# Altium schematic sheet Connectors.SchDoc
size 381 x 279 mm; Organization: SACO Technologies; Address1: 7806, Trans-Canada Hwy; Address2: Montreal, QC, Canada - H4S1L3.; Address3: H4S1L3; SheetNumber: 6; SheetTotal: 6; ELE682ProjectName: Conditionning & TLL PCB; ProjectRevision: C; SchDesignedBy1: Alexis Gagnon; SchDesignedBy2: Megane Cyr
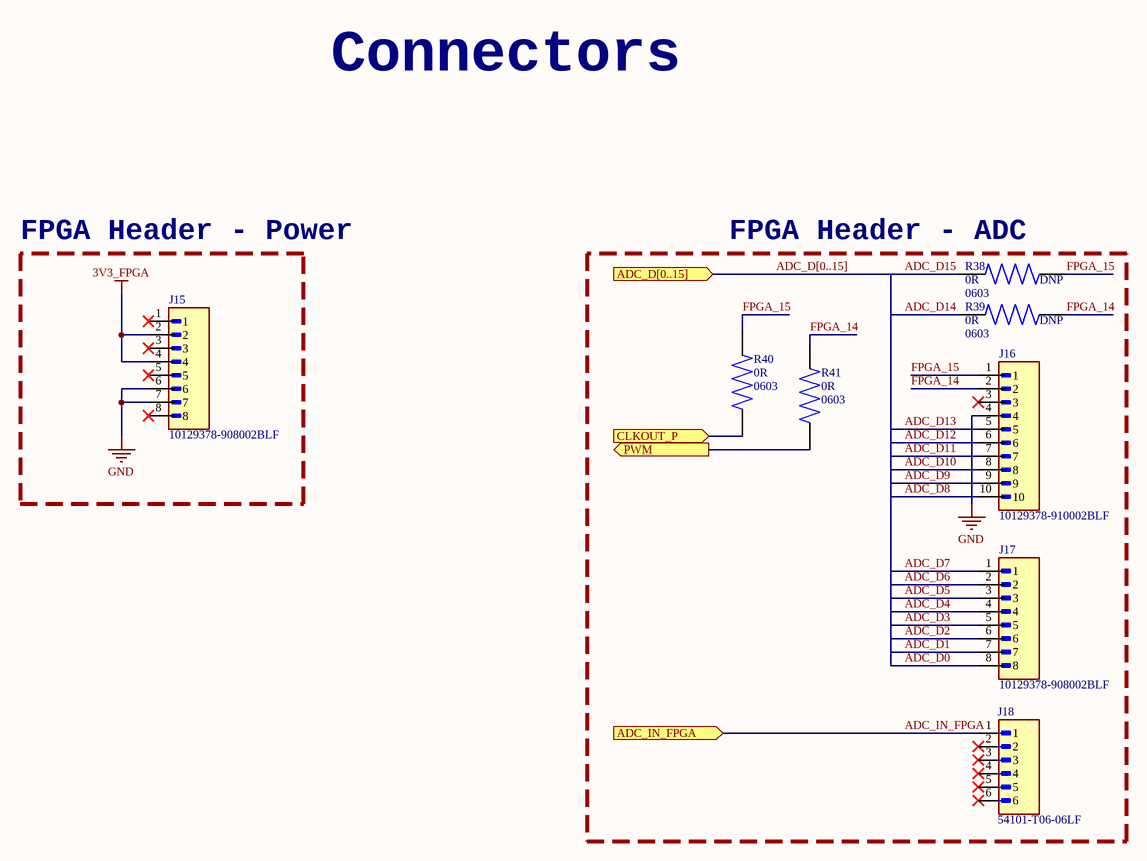
[diagram p0: Connectors.SchDoc]

## Parts
J15  10129378-908002BLF  [AMPHENOL_10129378-908002BLF]
J16  10129378-910002BLF  [AMPHENOL_10129378-910002BLF]
J17  10129378-908002BLF  [AMPHENOL_10129378-908002BLF]
J18  54101-T06-06LF  [AMPHENOL_54101-T06-06LF]
R38  value 0R  Package: 0603  [RESC1508X55N]  (hidden comment: RMCF0603ZT0R00)  (net tie)
R39  value 0R  Package: 0603  [RESC1508X55N]  (hidden comment: RMCF0603ZT0R00)  (net tie)
R40  value 0R  Package: 0603  [RESC1508X55N]  (hidden comment: RMCF0603ZT0R00)
R41  value 0R  Package: 0603  [RESC1508X55N]  (hidden comment: RMCF0603ZT0R00)

## Blocks framed on the sheet
FPGA Header - Power: J15
FPGA Header - ADC: J16-J18 R38-R41

## Ports
ADC_D[0..15] (in, see TopLevel[3B], Heating[5B], Power_MCU[1C]), ADC_IN_FPGA (in, see TopLevel[3B], Heating[1D]), CLKOUT_P (in, see TopLevel[3B], Heating[5B], Power_MCU[1C]), PWM (out, see TopLevel[3B], Heating[2B], Power_MCU[1D])

## Nets
3V3_FPGA: J15.2 J15.4
GND: J15.6 J15.7 J16.4
ADC_D0: J17.8
ADC_D1: J17.7
ADC_D2: J17.6
ADC_D3: J17.5
ADC_D4: J17.4
ADC_D5: J17.3
ADC_D6: J17.2
ADC_D7: J17.1
ADC_D8: J16.10
ADC_D9: J16.9
ADC_D10: J16.8
ADC_D11: J16.7
ADC_D12: J16.6
ADC_D13: J16.5
ADC_D14: R39.1
ADC_D15: R38.1
ADC_IN_FPGA: J18.1 ; port ADC_IN_FPGA
CLKOUT_P: R40.1 ; port CLKOUT_P
FPGA_14: J16.2 R39.2 R41.2
FPGA_15: J16.1 R38.2 R40.2
PWM: R41.1 ; port PWM

Not connected (* = marked no-connect by the designer): J15 1* 3* 5* 8*; J16 3*; J18 2* 3* 4* 5* 6*

## Buses and harness runs
bus ADC_D[0..15] = port ADC_D[0..15]

## Notes on the sheet
- Connectors
- (near R38) DNP
- (near R39) DNP
- Project:
- File:
- Date:
- Designed By :
- © COPYRIGHT 2024 École de Technologie Supérieure
- Revision:
- Sheet
- of
- 1100 Rue Notre-Dame Ouest, Montréal, QC H3C 1K3

## Library data of the parts
J15 J17 = 10129378-908002BLF: EconoStik&trade; 2.54mm, Board to Board Connector, Unshrouded Verticl Header, Through Hole, Single Row, 8 Positions, 2.54 mm (0.100in) Pitch.; MF: Amphenol; SnapEDA_Link: https://www.snapeda.com/parts/10129378-908002BLF/Amphenol/view-part/?ref=snap; Package: None; Value: *; MP: 10129378-908002BLF; Check_prices: https://www.snapeda.com/parts/10129378-908002BLF/Amphenol/view-part/?ref=eda
J18 = 54101-T06-06LF: BergStikÂ®, Board to Board connector, Unshrouded vertical Header, Through Hole, Single Row, 6 Positions, 2.54 mm Pitch.; MF: Amphenol ICC (FCI); Purchase-URL: https://pricing.snapeda.com/search/part/54101-T06-06LF/?ref=eda; MP: 54101-T06-06LF; SnapEDA_Link: https://www.snapeda.com/parts/54101-T06-06LF/Amphenol+FCI/view-part/?ref=snap; Value: *; Package: None; Price: None; Availability: In Stock; Check_prices: https://www.snapeda.com/parts/54101-T06-06LF/Amphenol+FCI/view-part/?ref=eda
R38-R41 = RMCF0603ZT0R00: 0 Ohms Jumper 0.1W, 1/10W Chip Resistor 0603 (1608 Metric) Automotive AEC-Q200 Thick Film; MF: Stackpole Electronics; SnapEDA_Link: https://www.snapeda.com/parts/RMCF0603ZT0R00/Stackpole+Electronics+Inc/view-part/?ref=snap; MP: RMCF0603ZT0R00; Check_prices: https://www.snapeda.com/parts/RMCF0603ZT0R00/Stackpole+Electronics+Inc/view-part/?ref=eda
J16 = 10129378-910002BLF: Package: None; Price: None; Value: *; MP: 10129378-910002BLF; Availability: Unavailable